# Altium schematic sheet TMouseEvent.schDoc: LiveDesign Evaluation - Video Windows
size A4; Organization: Altium Limited; Address1: L3, 12a Rodborough Rd; Address2: Frenchs Forest; Address3: NSW; Address4: Australia 2086; DocumentNumber: 12; SheetNumber: 12; SheetTotal: 20
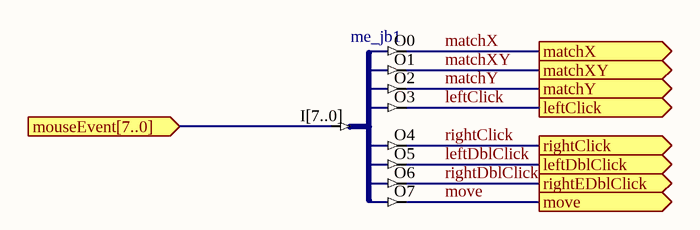
[diagram p0: TMouseEvent.schDoc]

## Parts
me_jb1  J4B_4S  (value not drawn)

## Ports
leftClick (out), leftDblClick (out), matchX (out), matchXY (out), matchY (out), mouseEvent[7..0] (in), move (out), rightClick (out), rightEDblClick (out)

## Nets
leftClick: me_jb1.O3 ; port leftClick
leftDblClick: me_jb1.O5 ; port leftDblClick
matchX: me_jb1.O0 ; port matchX
matchXY: me_jb1.O1 ; port matchXY
matchY: me_jb1.O2 ; port matchY
mouseEvent[7..0]: me_jb1.I[7..0] ; port mouseEvent[7..0]
move: me_jb1.O7 ; port move
rightClick: me_jb1.O4 ; port rightClick
rightDblClick: me_jb1.O6 ; port rightEDblClick

## Notes on the sheet
- Title
- Size:
- Date:
- A4
- Number:
- Time:
- Revision:
- Sheet
- of
- File:

## Library data of the parts
me_jb1 = J8B_8S: 8-Bit input bus to 8 single pin outputs; ArchiveName: GENERIC; Published: 9-30-2003; Publisher: Altium Limited; Core Revision: 1.00.00